# Altium schematic sheet Blues Brkr.SchDoc (part 1 of 3)
size 279 x 254 mm
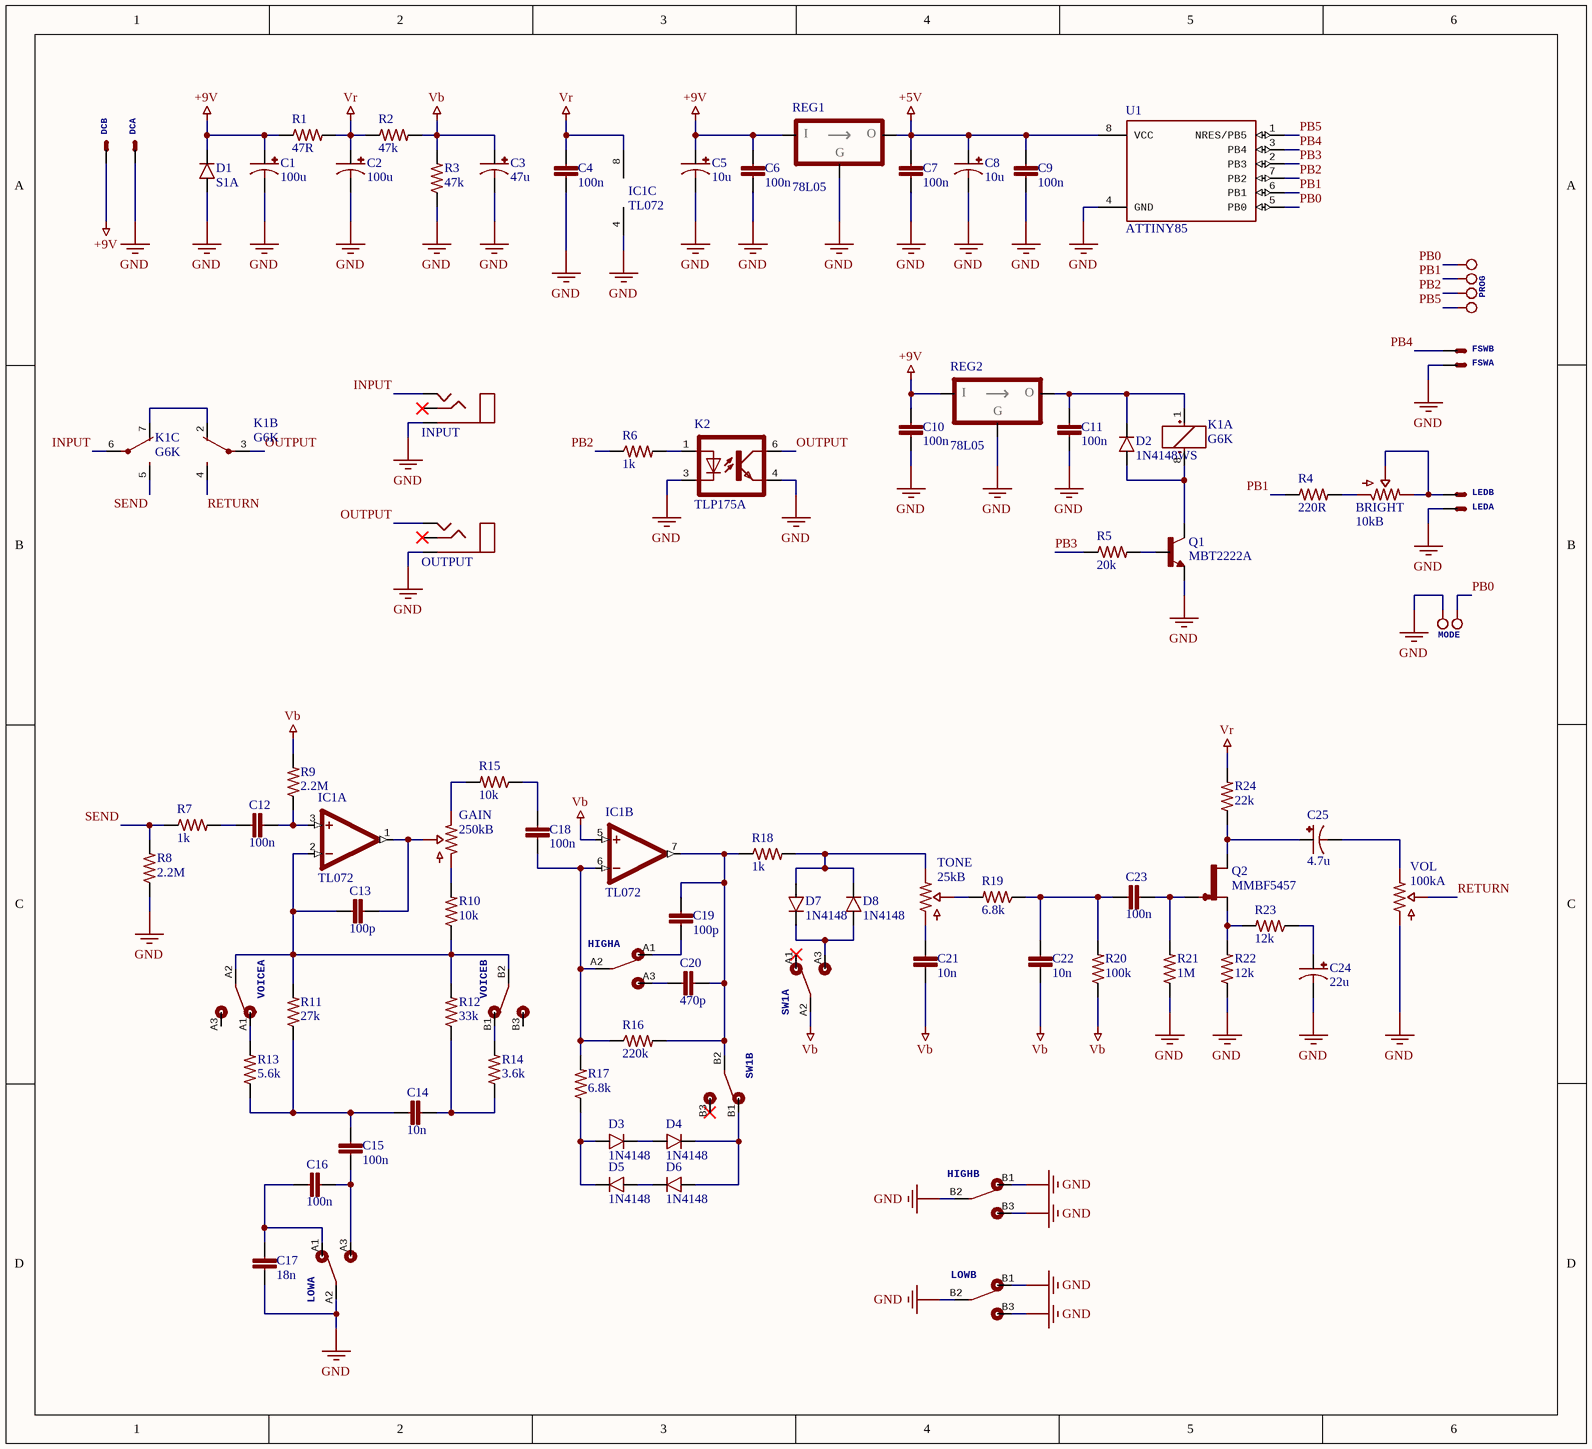
[diagram p0: Blues Brkr.SchDoc]

## Parts
BRIGHT  10kB  [BOURNS_3362P]
C1  100u  [CAPAE_D]
C2  100u  [CAPAE_D]
C3  47u  [CAPAE_D]
C4  100n  [CHIP_0603]
C5  10u  [CAPAE_B]
C6  100n  [CHIP_0603]
C7  100n  [CHIP_0603]
C8  10u  [CAPAE_B]
C9  100n  [CHIP_0603]
C10  100n  [CHIP_0603]
C11  100n  [CHIP_0603]
C12  100n  [CHIP_1206]
C13  100p  [CHIP_0603]
C14  10n  [CHIP_0603]
C15  100n  [CHIP_1206]
C16  100n  [CHIP_1206]
C17  18n  [CHIP_0805]
C18  100n  [CHIP_1206]
C19  100p  [CHIP_0603]
C20  470p  [CHIP_0603]
C21  10n  [CHIP_0603]
C22  10n  [CHIP_0603]
C23  100n  [CHIP_1206]
C24  22u  [CAPAE_D]
C25  4.7u  [CAPAE_C]
D1  S1A  [DO214]
D2  1N4148WS  [SOD323]
D3  1N4148  [DO35_2]
D4  1N4148  [DO35_2]
D5  1N4148  [DO35_2]
D6  1N4148  [DO35_2]
D7  1N4148  [DO35_2]
D8  1N4148  [DO35_2]
DC  J_JST-XH-02  [JST-XH-02]  (value not drawn)  (parts A,B of 2)
FSW  (no value)  [JST-XH-02]  (parts A,B of 2)
GAIN  250kB  [ALPHA_16mm_BOTTOM]
HIGH  DPDT  [DPDT_SLIDE]  (value not drawn)  (parts A,B of 2)
IC1  TL072  [SO-8]  (parts A,B,C of 3)
INPUT  (no value)  [STEREO]
K1  G6K  [G6K]  (parts A,B,C of 3)
K2  TLP175A  [TLP175A]
LED  (no value)  [JST-XH-02]  (parts A,B of 2)
LOW  DPDT  [DPDT_SLIDE]  (value not drawn)  (parts A,B of 2)
MODE  HEADER_2PINS  [HEADER_2PINS]  (value not drawn)
OUTPUT  (no value)  [STEREO]
PROG  J_HEADER_4PINS_FEM  [HEADER_4Pins_FEM]  (value not drawn)
Q1  MBT2222A  [SOT323]
Q2  MMBF5457  [SOT23]
R1  47R  [CHIP_R_1206]
R2  47k  [CHIP_R_1206]
R3  47k  [CHIP_R_1206]
R4  220R  [CHIP_R_1206]
R5  20k  [CHIP_R_0603]
R6  1k  [CHIP_R_0603]
R7  1k  [CHIP_R_0603]
R8  2.2M  [CHIP_R_0603]
R9  2.2M  [CHIP_R_0603]
R10  10k  [CHIP_R_0603]
R11  27k  [CHIP_R_0603]
R12  33k  [CHIP_R_0603]
R13  5.6k  [CHIP_R_0603]
R14  3.6k  [CHIP_R_0603]
R15  10k  [CHIP_R_0603]
R16  220k  [CHIP_R_0603]
R17  6.8k  [CHIP_R_0603]
R18  1k  [CHIP_R_0603]
R19  6.8k  [CHIP_R_0603]
R20  100k  [CHIP_R_0603]
R21  1M  [CHIP_R_0603]
R22  12k  [CHIP_R_0603]
R23  12k  [CHIP_R_0603]
R24  22k  [CHIP_R_0603]
REG1  78L05  [SOT23-3]
REG2  78L05  [SOT23-3]
SW1  DPDT  [DPDT]  (value not drawn)  (parts A,B of 2)
TONE  25kB  [ALPHA_16mm_BOTTOM]
U1  ATTINY85  [SOP8]
VOICE  DPDT  [DPDT_SLIDE]  (value not drawn)  (parts A,B of 2)
VOL  100kA  [ALPHA_16mm_BOTTOM]

## Nets
+5V: C7.1 C8.+ C9.1 REG1.1(OUTPUT) U1.8(VCC)
+9V: C1.+ C5.+ C6.1 C10.1 D1.1 DC.1(S) R1.1 REG1.2(INPUT) REG2.2(INPUT)
GND: C1.- C2.- C3.- C4.2 C5.- C6.2 C7.2 C8.- C9.2 C10.2 C11.2 C17.2 C24.- D1.2 DC.2(S) FSW.2(S) HIGH.B1 HIGH.B2 HIGH.B3 IC1.4(V-) INPUT.S K2.3(C) K2.4(EMIT) LED.2(S) LOW.A2 LOW.B1 LOW.B2 LOW.B3 MODE.1 OUTPUT.S Q1.2(E) R3.1 R8.1 R21.1 R22.1 REG1.3(COMMON) REG2.3(COMMON) U1.4(GND) VOL.1
Vb: C3.+ C21.2 C22.2 IC1.5(+IN) R2.2 R3.2 R9.2 R20.1 SW1.A2
Vr: C2.+ C4.1 IC1.8(V+) R1.2 R2.1 R24.2
INPUT: INPUT.T K1.6(P)
OUTPUT: K1.3(P) K2.6(COL) OUTPUT.T
PB0: MODE.2 PROG.4 U1.5(PB0)
PB1: PROG.3 R4.1 U1.6(PB1)
PB2: PROG.2 R6.1 U1.7(PB2)
PB3: R5.1 U1.2(PB3)
PB4: FSW.1(S) U1.3(PB4)
PB5: PROG.1 U1.1(NRES/PB5)
RETURN: K1.4(S) VOL.2
SEND: K1.5(S) R7.1 R8.2
NetBRIGHT_1: BRIGHT.1 R4.2
NetBRIGHT_2: BRIGHT.2 BRIGHT.3 LED.1(S)
NetC11_1: C11.1 D2.1 K1.1(+) REG2.1(OUTPUT)
NetC12_1: C12.1 IC1.3(+IN) R9.1
NetC12_2: C12.2 R7.2
NetC13_1: C13.1 GAIN.2 IC1.1(OUT)
NetC13_2: C13.2 IC1.2(-IN) R10.1 R11.2 R12.2 VOICE.A2 VOICE.B2
NetC14_1: C14.1 R12.1 R14.1
NetC14_2: C14.2 C15.1 R11.1 R13.1
NetC15_2: C15.2 C16.2 LOW.A3
NetC16_1: C16.1 C17.1 LOW.A1
NetC18_1: C18.1 R15.1
NetC18_2: C18.2 HIGH.A2 IC1.6(-IN) R16.1 R17.2
NetC19_1: C19.1 C20.1 IC1.7(OUT) R16.2 R18.1 SW1.B2
NetC19_2: C19.2 HIGH.A1
NetC20_2: C20.2 HIGH.A3
NetC21_1: C21.1 TONE.1
NetC22_1: C22.1 C23.2 R19.1 R20.2
NetC23_1: C23.1 Q2.3(G) R21.2
NetC24_+: C24.+ R23.1
NetC25_+: C25.+ Q2.1(D) R24.1
NetC25_-: C25.- VOL.3
NetD2_2: D2.2 K1.8(-) Q1.3(C)
NetD3_A: D3.A D5.C R17.1
NetD3_C: D3.C D4.A
NetD4_C: D4.C D6.A SW1.B1
NetD5_A: D5.A D6.C
NetD7_A: D7.A D8.C R18.2 TONE.3
NetD7_C: D7.C D8.A SW1.A3
NetGAIN_1: GAIN.1 R10.2
NetGAIN_3: GAIN.3 R15.2
NetK1_2: K1.2(O) K1.7(O)
NetK2_1: K2.1(A) R6.2
NetQ1_1: Q1.1(B) R5.2
NetQ2_2: Q2.2(S) R22.2 R23.2
NetR13_2: R13.2 VOICE.A1
NetR14_2: R14.2 VOICE.B1
NetR19_2: R19.2 TONE.2

Not connected (* = marked no-connect by the designer): INPUT R*; OUTPUT R*; SW1 A1(1)* B3(3)*; VOICE A3(3) B3(3)